# Altium schematic sheet ListOfDongles.SchDoc
size A
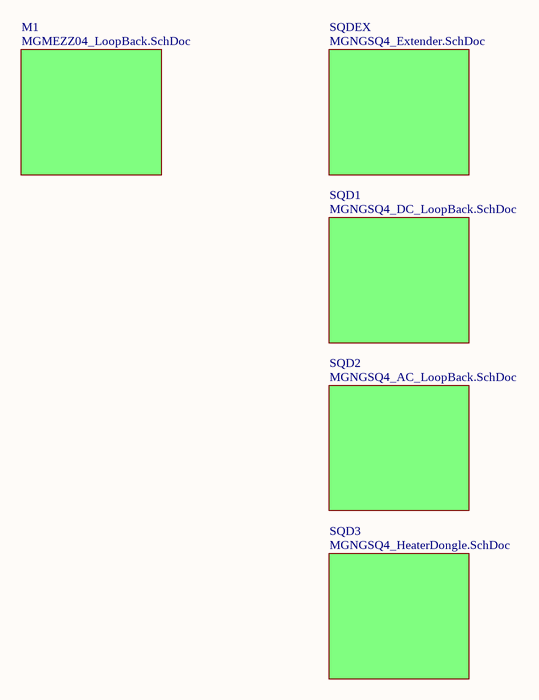
[diagram p0: ListOfDongles.SchDoc]

## Sub-sheets
M1 = MGMEZZ04_LoopBack.SchDoc: no entries
SQD1 = MGNGSQ4_DC_LoopBack.SchDoc: no entries
SQD2 = MGNGSQ4_AC_LoopBack.SchDoc: no entries
SQD3 = MGNGSQ4_HeaterDongle.SchDoc: no entries
SQDEX = MGNGSQ4_Extender.SchDoc: no entries